# EAGLE design led (EAGLE 7.6.0)
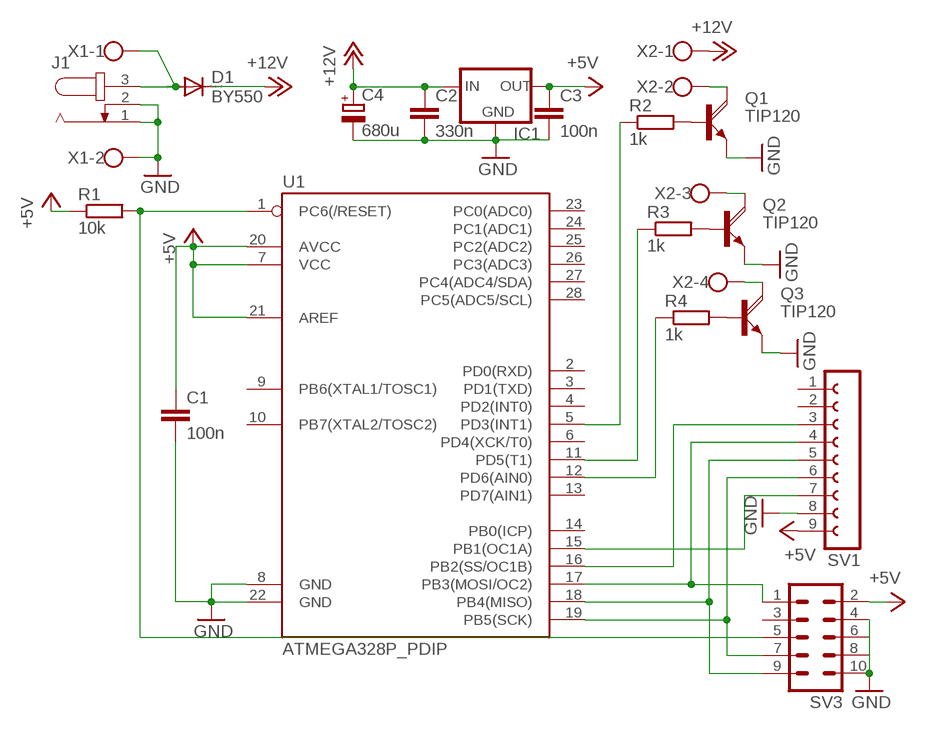
[diagram p0: schematic, sheet 1]

## Parts
C1  100n  C-EU050-024X044  [C050-024X044]
C2  330n  C-EU050-024X044  [C050-024X044]
C3  100n  C-EU050-024X044  [C050-024X044]
C4  680u  CPOL-EUE5-10.5  [E5-10,5]
D1  BY550  [DO27-15]
IC1  78XXS  [78XXS]
J1  JACK-PLUG1  [SPC4078]
Q1  TIP120  [TO220AV]
Q2  TIP120  [TO220AV]
Q3  TIP120  [TO220AV]
R1  10k  R-EU_0207/10  [0207/10]
R2  1k  R-EU_0207/10  [0207/10]
R3  1k  R-EU_0207/10  [0207/10]
R4  1k  R-EU_0207/10  [0207/10]
SV1  FE09-1  [FE09]
SV3  MA05-2  [MA05-2]
U1  ATMEGA328P_PDIP  [DIL28-3]
X1  W237-102  [W237-102]
X2  W237-4  [W237-4]

## Nets
+5V: C1.1 C3.1 IC1.OUT R1.1 SV1.9 SV3.2 U1.7(VCC) U1.20(AVCC) U1.21(AREF)
+12V [3amp]: C2.1 C4.+ D1.C IC1.IN X2.1
GND: C1.2 C2.2 C3.2 C4.- IC1.GND J1.1 J1.2 Q1.E Q2.E Q3.E SV1.8 SV3.4 SV3.10 U1.8(GND) U1.22(GND) X1.2
N$1 [3amp]: Q3.C X2.4
N$2: SV1.5 SV3.9 U1.18(PB4(MISO))
N$3 [3amp]: D1.A J1.3 X1.1
N$4: Q1.B R2.2
N$5: R1.2 SV3.5 U1.1(PC6(/RESET))
N$6: SV1.4 SV3.1 U1.17(PB3(MOSI/OC2))
N$7: SV1.3 U1.16(PB2(SS/OC1B))
N$8: SV1.7 U1.15(PB1(OC1A))
N$9 [3amp]: Q2.C X2.3
N$10 [3amp]: Q1.C X2.2
N$11: R4.1 U1.12(PD6(AIN0))
N$12: R3.1 U1.11(PD5(T1))
N$13: R2.1 U1.5(PD3(INT1))
N$14: SV1.6 SV3.7 U1.19(PB5(SCK))
N$15: Q2.B R3.2
N$16: Q3.B R4.2
Unconnected: SV1.1 SV1.2 SV3.3 SV3.6 SV3.8 U1.2(PD0(RXD)) U1.3(PD1(TXD)) U1.4(PD2(INT0)) U1.6(PD4(XCK/T0)) U1.9(PB6(XTAL1/TOSC1)) U1.10(PB7(XTAL2/TOSC2)) U1.13(PD7(AIN1)) U1.14(PB0(ICP)) U1.23(PC0(ADC0)) U1.24(PC1(ADC1)) U1.25(PC2(ADC2)) U1.26(PC3(ADC3)) U1.27(PC4(ADC4/SDA)) U1.28(PC5(ADC5/SCL))

## Library data of the parts
C1-C3 = rcl:C-EU: CAPACITOR, European symbol
C4 = rcl:CPOL-EU: POLARIZED CAPACITOR, European symbol
D1 = diode:BY550: DIODE Si200 V, 5 A
IC1 = v-reg:78XXS: VOLTAGE REGULATOR
J1 = con-jack:JACK-PLUG: DC POWER JACK Power Jack, DC, Right Angle, Through Hole, Rated 5A at 16VDC, PC Terminals Distributor: Farnell (www.Farnell.de) Drawing: 84N1161.pdf / 84N1162.pdf Manufacturer: SPC Technology (www.spctechnology.com) Type: SPC4077 / SPC 4078; OC_FARNELL: unknown; OC_NEWARK: unknown
Q1-Q3 = transistor-power:TIP120: NPN DARLINGTON TRANSISTOR
R1 = resistor:R-EU_: RESISTOR, European symbol
R2-R4 = rcl:R-EU_: RESISTOR, European symbol
SV1 = con-lsta:FE09-1: FEMALE HEADER; OC_FARNELL: unknown; OC_NEWARK: unknown
SV3 = con-lstb:MA05-2: PIN HEADER; OC_FARNELL: unknown; OC_NEWARK: unknown
U1 = SparkFun-DigitalIC:ATMEGA328P_PDIP: uC used in the Arduino 32kb flash, 1k EEPROM, 2k SRAM This is the through-hole version of this chip.
X1 = con-wago-500:W237-102: WAGO SCREW CLAMP; MPN: 237-102; OC_FARNELL: unknown; OC_NEWARK: 70K9898
X2 = con-wago-500:W237-4: WAGO SCREW CLAMP; OC_FARNELL: unknown; OC_NEWARK: unknown

## Net classes
0 default: width 0.61 mm, clearance 0.61 mm
1 3amp: width 1.219 mm, clearance 0.813 mm

## Board
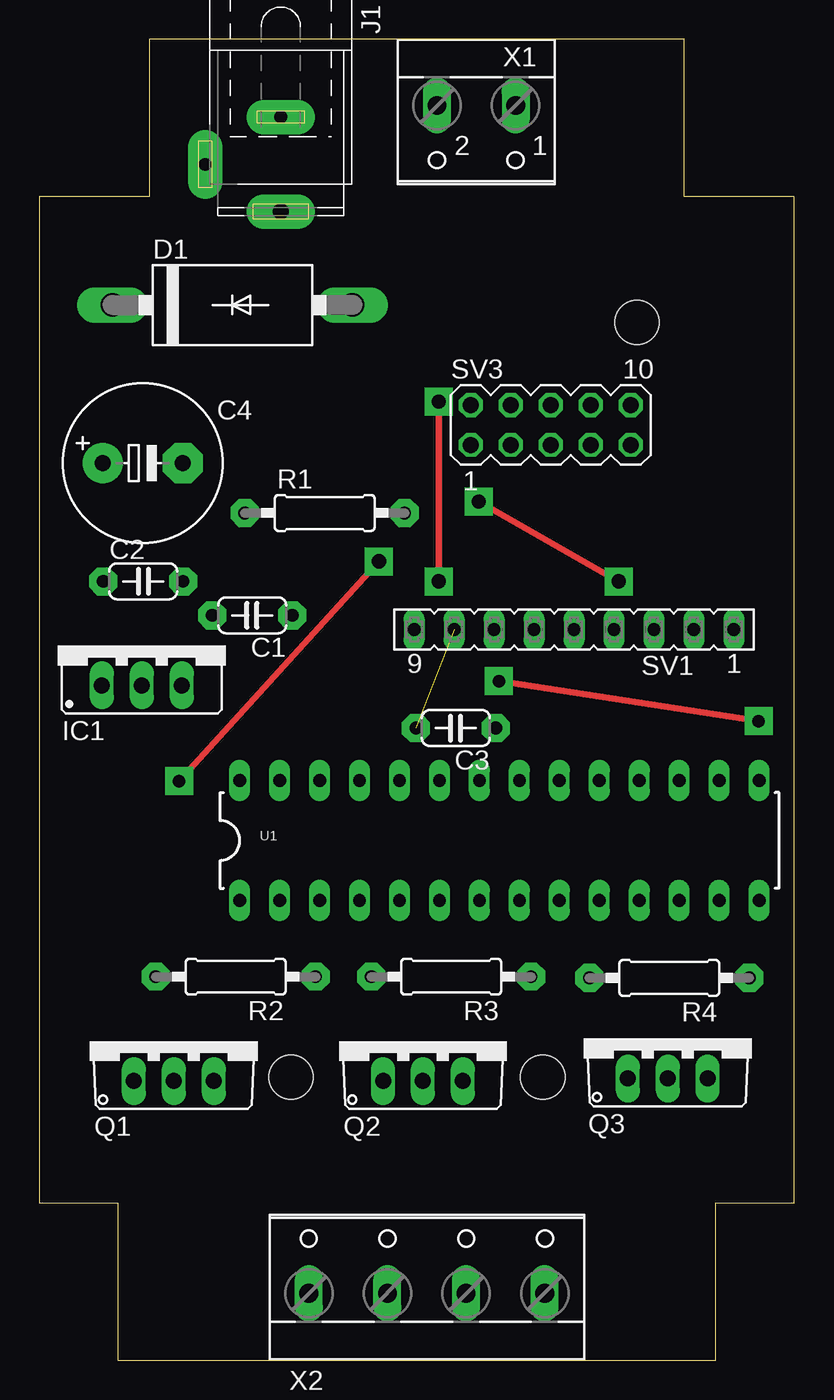
[diagram p1: board, top side]
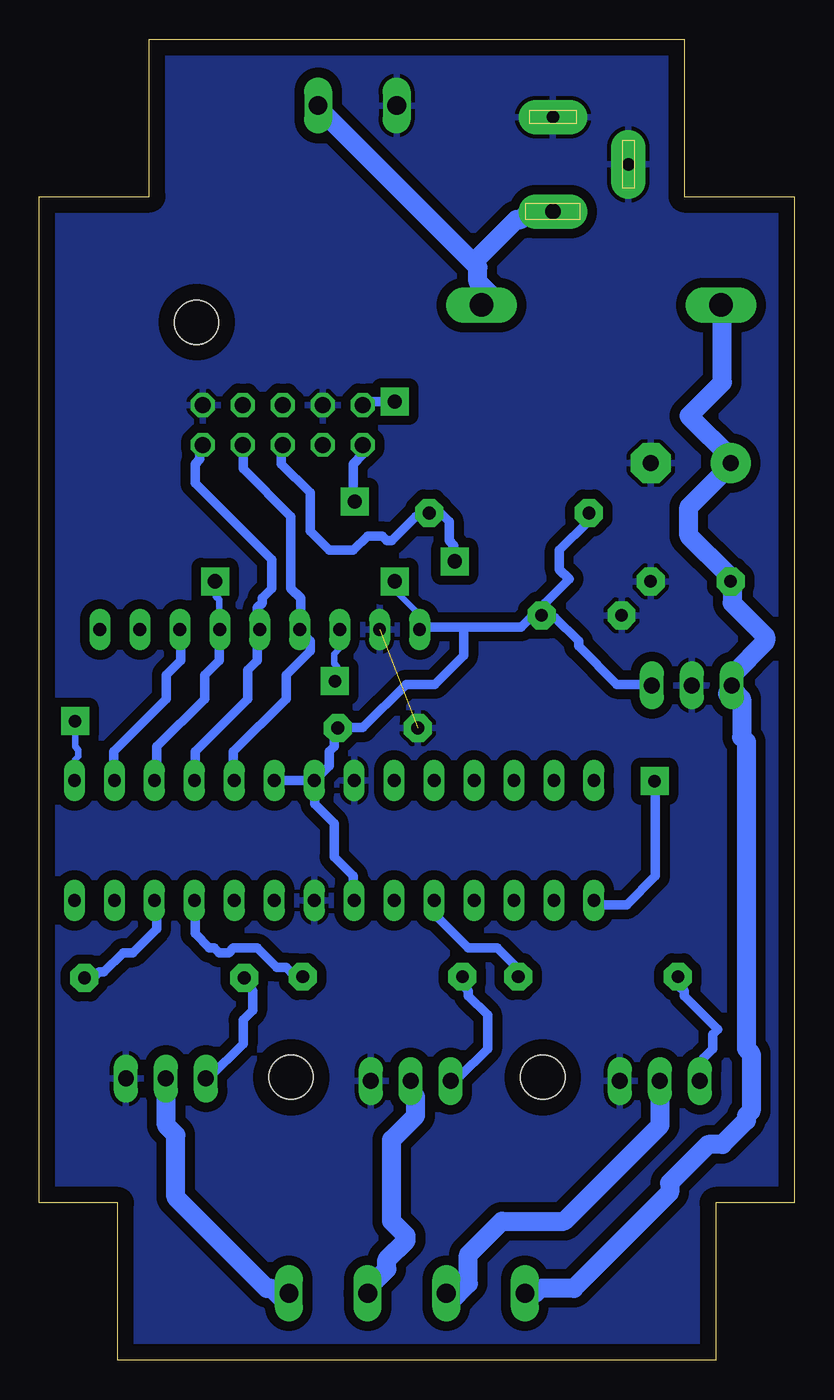
[diagram p2: board, bottom side, seen from below]

Size 48 x 84 mm. Coordinates in mm from the lower left corner, seen from the top.
Outline: 0,10 5,10 5,0 43,0 43,10 48,10 48,74 41,74 41,84 7,84 7,74 0,74 0,10
Copper layers (1*16): Top 0.035mm / dielectric 1.5mm / Bottom 0.035mm
Design rules "default": minimum track width 10mil, minimum drill 24mil, track to track 8mil, track to pad 8mil, pad to pad 8mil, via to via 8mil, smd to smd 8mil, copper to edge 40mil, drill to drill 8mil, minimum pad ring 10mil, minimum via ring 8mil, stop-mask expansion 4mil, vias tented up to drill 0mil, thermal gap 10mil
Holes 2.8 mm at 16,18 32,18 38,66

### Footprints (pad centres in the part's own frame; a part is rotated, then mirrored left to right if it is on the bottom)
C050-024X044 = drill 0.813 pad 1.778 octagon: 1 -2.54,0; 2 2.54,0
E5-10,5 = drill 1.016 pad 2.54: + -2.54,0 | drill 1.016 pad 2.54 octagon: - 2.54,0
DO27-15 = drill 1.499 long: A 7.62,0; C -7.62,0
78XXS = drill 1.016 long: GND 0,-2.54; IN -2.54,-2.54; OUT 2.54,-2.54
SPC4078 = drill 0.8 pad 2.184 long: 1 -3,0; 2 0,-4.8 | drill 1 pad 2.184 long: 3 3,0
TO220AV = drill 1.016 long: B -2.54,-2.54; C 0,-2.54; E 2.54,-2.54
0207/10 = drill 0.813 pad 1.778 octagon: 1 -5.08,0; 2 5.08,0
FE09 = drill 0.813 long: 1 -10.16,0; 2 -7.62,0; 3 -5.08,0; 4 -2.54,0; 5 0,0; 6 2.54,0; 7 5.08,0; 8 7.62,0; 9 10.16,0
MA05-2 = drill 1.016 octagon: 1 -5.08,-1.27; 2 -5.08,1.27; 3 -2.54,-1.27; 4 -2.54,1.27; 5 0,-1.27; 6 0,1.27; 7 2.54,-1.27; 8 2.54,1.27; 9 5.08,-1.27; 10 5.08,1.27
DIL28-3 = drill 0.813 long: 1 -16.51,-3.81; 2 -13.97,-3.81; 3 -11.43,-3.81; 4 -8.89,-3.81; 5 -6.35,-3.81; 6 -3.81,-3.81; 7 -1.27,-3.81; 8 1.27,-3.81; 9 3.81,-3.81; 10 6.35,-3.81; 11 8.89,-3.81; 12 11.43,-3.81; 13 13.97,-3.81; 14 16.51,-3.81; 15 16.51,3.81; 16 13.97,3.81; 17 11.43,3.81; 18 8.89,3.81; 19 6.35,3.81; 20 3.81,3.81; 21 1.27,3.81; 22 -1.27,3.81; 23 -3.81,3.81; 24 -6.35,3.81; 25 -8.89,3.81; 26 -11.43,3.81; 27 -13.97,3.81; 28 -16.51,3.81
W237-102 = drill 1.194 long: 1 -2.5,-1.27; 2 2.5,-1.27
W237-4 = drill 1.194 long: 1 -7.5,-1.27; 2 -2.5,-1.27; 3 2.5,-1.27; 4 7.5,-1.27

### Placement (x,y rotation side)
C1  13.53,47.37 180 top
C2  6.6,49.53 0 top
C3  26.48,40.2 180 top
C4  6.58,57.05 0 top
D1  12.28,67.1 0 top
IC1  6.52,45.45 0 top
J1  15.35,76.05 270 top
Q1  8.55,20.29 0 top
Q2  24.39,20.29 0 top
Q3  39.95,20.45 0 top
R1  18.14,53.88 0 top
R2  12.48,24.39 180 top
R3  26.18,24.39 180 top
R4  40.05,24.31 180 top
SV1  33.99,46.47 180 top
SV3  32.52,59.48 0 top
U1  29.25,33.05 0 top
X1  27.78,78.52 180 top
X2  24.63,5.53 0 top

### Tracks (layer width: path | path; a pad name or v marks a point on that pad's centre or on a via)
+5V  (via drill 0.9 pad 1.78)
  Top 0.406: v25.4,49.53 v25.4,60.96
  Bottom 0.406: v25.4,49.53 25.4,48.97 23.98,47.55 23.98,46.53 SV1.9
  Bottom 0.61: U1.7 28.04,29.26 28.04,30.79 29.26,32 29.26,34.14 30.48,35.36 30.48,36.58 U1.21 | U1.20 32.92,36.88 30.79,36.88 U1.21 | U1.21 30.48,36.88 29.57,37.8 29.57,38.71 29.26,39.01 29.26,39.93 C3.1 28.96,40.23 27.43,40.23 24.69,42.98 22.86,42.98 21.03,44.81 21.03,46.63 | v25.4,60.96 27.43,60.96 SV3.2 | IC1.OUT 9.14,42.98 11.28,42.98 13.72,45.41 13.72,45.72 15.24,47.24 15.85,47.24 C1.1 | 21.03,46.63 17.37,46.63 16.76,47.24 16.15,47.24 C1.1 | 21.03,46.63 23.77,46.63 SV1.9 | R1.1 13.11,53.65 13.11,53.34 14.94,51.51 14.94,50.29 14.33,49.68 15.85,48.16 15.85,47.55 C1.1
+12V
  Bottom 1.219: D1.C 4.57,67.06 4.57,62.18 6.71,60.05 3.96,57.3 C4.+ 4.27,56.69 6.71,54.25 6.71,52.43 4.27,49.99 C2.1 3.96,49.38 3.96,48.16 1.83,46.02 1.83,45.72 3.96,43.59 3.96,42.98 IC1.IN 4.27,42.37 3.96,42.06 3.66,42.37 3.35,42.06 3.35,39.62 3.05,39.32 3.05,19.81 2.74,19.51 2.74,15.85 3.05,15.54 3.05,15.24 4.57,13.72 5.49,13.72 7.92,11.28 7.92,10.67 14.02,4.57 16.15,4.57 16.46,4.27 17.07,4.27 X2.1
GND  (1 unrouted)
  pour Bottom: 0,74 7,74 7,84 41,84 41,74 48,74 48,10 43,10 43,0 5,0 5,10 0,10
N$1
  Bottom 1.219: Q3.C 39.93,17.68 39.93,14.94 39.32,14.33 39.32,10.36 33.53,4.57 33.22,4.57 32.31,3.66 32,3.96 X2.4
N$2
  Bottom 0.61: U1.18 38.1,36.88 38.1,38.71 34.75,42.06 34.75,43.89 34.14,44.5 34.14,46.33 SV1.5 34.14,46.63 34.14,47.85 33.83,48.16 33.83,48.46 33.22,49.07 33.22,50.9 38.1,55.78 38.1,57 37.8,57.3 37.8,57.91 SV3.9
N$3
  Bottom 1.219: 20.42,69.8 20.12,69.49 20.12,68.58 19.2,67.67 19.81,67.06 D1.A | 20.42,69.8 30.18,79.55 X1.1 | 20.42,69.8 17.68,72.54 17.37,72.54 17.07,72.85 15.54,72.85 J1.3
N$4
  Bottom 0.61: Q1.B 5.79,17.98 5.79,19.2 5.18,19.81 5.18,20.73 4.88,21.03 7.01,23.16 7.01,23.47 7.32,23.77 7.32,24.38 R2.2
N$5  (via drill 0.8 pad 1.78, 0.9 pad 1.78)
  Top 0.406: v21.59,50.8 v8.89,36.83
  Bottom 0.406: 8.94,36.78 v8.89,36.83 | 21.54,50.8 v21.59,50.8
  Bottom 0.61: U1.1 12.5,28.96 10.67,28.96 8.84,30.79 8.84,36.58 v8.89,36.83 | SV3.5 32.61,57.91 32.61,57 30.79,55.17 30.79,52.73 29.57,51.51 28.04,51.51 27.13,52.43 26.21,52.43 25.91,52.12 25.6,52.12 24.08,53.65 23.47,53.65 R1.2 23.16,53.95 22.55,53.95 21.95,53.34 21.95,52.12 21.64,51.82 21.64,50.9 v21.59,50.8
N$6  (via drill 0.9 pad 1.78)
  Top 0.406: v27.94,54.61 v36.83,49.53
  Bottom 0.406: 27.84,54.66 v27.94,54.61 27.84,54.86 | 36.78,49.38 v36.83,49.53 36.78,49.17 36.78,48.56 36.58,48.36 36.58,46.53 SV1.4
  Bottom 0.61: U1.17 40.54,36.88 40.54,39.01 37.49,42.06 37.49,43.59 36.58,44.5 36.58,46.33 SV1.4 | SV3.1 27.43,57.91 27.43,57.61 28.04,57 28.04,54.86 v27.94,54.61
N$7
  Bottom 0.61: U1.16 43.28,36.88 43.28,38.71 39.93,42.06 39.93,43.59 39.01,44.5 39.01,46.33 SV1.3
N$8  (via drill 0.8 pad 1.78)
  Top 0.406: v29.21,43.18 v45.72,40.64
  Bottom 0.406: 29.06,43.28 v29.21,43.18 29.06,43.48 29.06,44.09 29.26,44.3 29.26,44.91 28.85,45.31 28.85,46.33 SV1.7 | v45.72,40.64 45.72,39.01 45.52,38.81 45.52,38.41 45.72,38.2 45.72,36.98 U1.15
N$9
  Bottom 1.219: Q2.C 24.38,17.68 24.38,17.07 24.08,16.76 24.08,15.54 25.6,14.02 25.6,8.84 24.69,7.92 24.69,7.62 25.91,6.4 25.91,5.79 27.43,4.27 X2.3
N$10
  Bottom 1.219: Q1.C 8.53,17.68 8.53,14.94 14.63,8.84 18.59,8.84 20.73,6.71 20.73,4.88 21.95,3.66 22.25,3.96 X2.2
N$11
  Bottom 0.61: U1.12 40.54,28.96 40.54,27.43 42.06,25.91 42.67,25.91 43.89,24.69 44.2,24.69 44.5,24.38 45.11,24.38 R4.1
N$12
  Bottom 0.61: U1.11 38.1,28.96 38.1,27.13 37.19,26.21 36.88,26.21 36.58,25.91 35.97,25.91 35.66,26.21 34.14,26.21 32.92,24.99 32.31,24.99 32,24.69 31.39,24.69 R3.1
N$13
  Bottom 0.61: U1.5 22.86,28.96 22.86,28.35 20.73,26.21 18.9,26.21 17.37,24.69 R2.1
N$14
  Bottom 0.61: U1.19 35.66,36.88 35.66,38.71 32.31,42.06 32.31,43.59 30.79,45.11 30.79,45.72 31.39,46.33 SV1.6 31.39,46.63 31.39,48.46 32,49.07 32,53.65 35.05,56.69 35.05,57.91 SV3.7
N$15
  Bottom 0.61: Q2.B 21.64,17.98 21.34,17.98 19.51,19.81 19.51,21.95 20.73,23.16 20.73,23.47 21.03,23.77 21.03,24.38 R3.2
N$16
  Bottom 0.61: Q3.B 37.19,17.98 35.05,20.12 35.05,21.64 34.44,22.25 34.44,23.47 35.05,24.08 R4.2